# Altium schematic sheet [04]USB.SchDoc
size A4
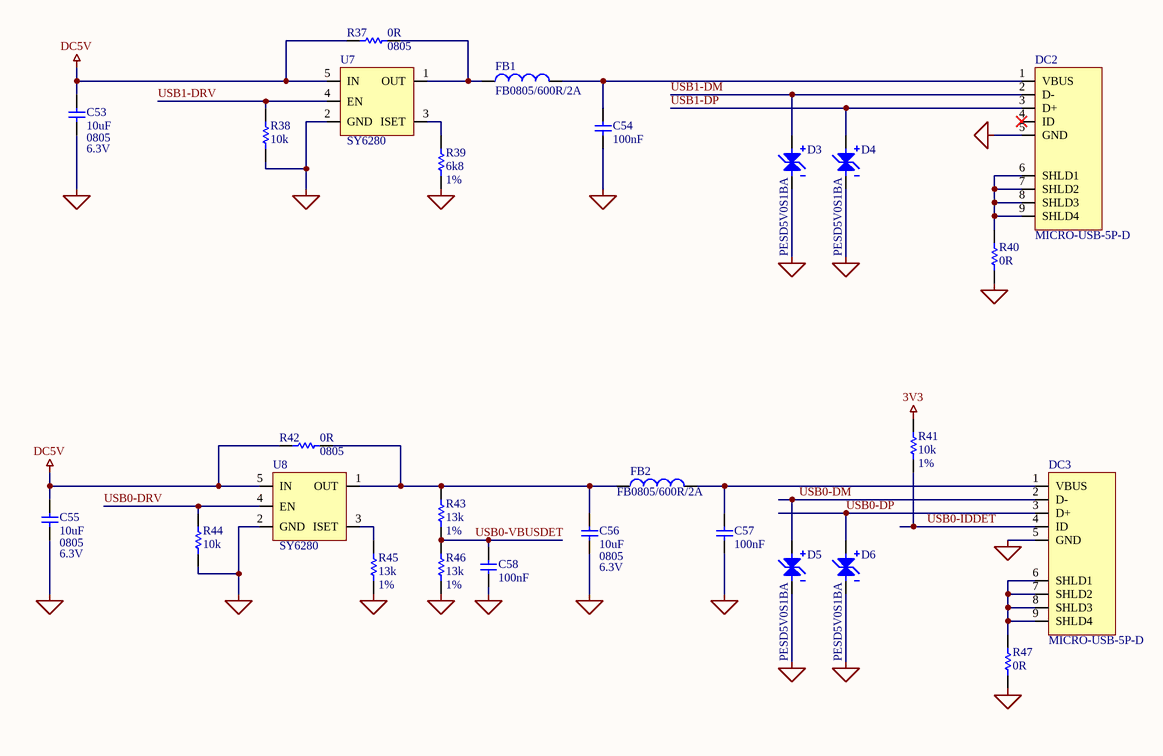
[diagram p0: [04]USB.SchDoc]

## Parts
C53  value 10uF  Voltage: 6.3V  Package / Case: 0805  [C0805]  (hidden comment: SMD Capacitor Chip)
C54  value 100nF  [C0402]  (hidden comment: SMD Capacitor Chip)
C55  value 10uF  Voltage: 6.3V  Package / Case: 0805  [C0805]  (hidden comment: SMD Capacitor Chip)
C56  value 10uF  Voltage: 6.3V  Package / Case: 0805  [C0805]  (hidden comment: SMD Capacitor Chip)
C57  value 100nF  [C0402]  (hidden comment: SMD Capacitor Chip)
C58  value 100nF  [C0402]  (hidden comment: SMD Capacitor Chip)
D3  MPN: PESD5V0S1BA  (hidden comment: SMD ESD Diode)
D4  MPN: PESD5V0S1BA  (hidden comment: SMD ESD Diode)
D5  MPN: PESD5V0S1BA  (hidden comment: SMD ESD Diode)
D6  MPN: PESD5V0S1BA  (hidden comment: SMD ESD Diode)
DC2  MPN: MICRO-USB-5P-D  (hidden comment: SMD USB Jack)
DC3  MPN: MICRO-USB-5P-D  (hidden comment: SMD USB Jack)
FB1  value FB0805/600R/2A  (hidden comment: SMD Coil Chip)
FB2  value FB0805/600R/2A  (hidden comment: SMD Coil Chip)
R37  value 0R  Package / Case: 0805  (hidden comment: SMD Resistor Chip)
R38  value 10k  (hidden comment: SMD Resistor Chip)
R39  value 6k8  Tolerance: 1%  (hidden comment: SMD Resistor Chip)
R40  value 0R  (hidden comment: SMD Resistor Chip)
R41  value 10k  Tolerance: 1%  (hidden comment: SMD Resistor Chip)
R42  value 0R  Package / Case: 0805  (hidden comment: SMD Resistor Chip)
R43  value 13k  Tolerance: 1%  (hidden comment: SMD Resistor Chip)
R44  value 10k  (hidden comment: SMD Resistor Chip)
R45  value 13k  Tolerance: 1%  (hidden comment: SMD Resistor Chip)
R46  value 13k  Tolerance: 1%  (hidden comment: SMD Resistor Chip)
R47  value 0R  (hidden comment: SMD Resistor Chip)
U7  SMD Power Distribution Switch  (value not drawn)
U8  SMD Power Distribution Switch  (value not drawn)

## Nets
3V3: R41.1
DC5V: C53.1 C55.1 R37.1 R42.1 U7.5(IN) U8.5(IN)
SGND: C53.2 C54.1 C55.2 C56.2 C57.1 C58.1 D3.2 D4.2 D5.2 D6.2 DC2.5(GND) DC3.5(GND) R38.2 R39.2 R40.2 R44.2 R45.2 R46.2 R47.2 U7.2(GND) U8.2(GND)
USB0-DM: D5.1 DC3.2(D-)
USB0-DP: D6.1 DC3.3(D+)
USB0-DRV: R44.1 U8.4(EN)
USB0-IDDET: DC3.4(ID) R41.2
USB0-VBUSDET: C58.2 R43.2 R46.1
USB1-DM: D3.1 DC2.2(D-)
USB1-DP: D4.1 DC2.3(D+)
USB1-DRV: R38.1 U7.4(EN)
NetC54_2: C54.2 DC2.1(VBUS) FB1.2
NetC56_1: C56.1 FB2.1 R42.2 R43.1 U8.1(OUT)
NetC57_2: C57.2 DC3.1(VBUS) FB2.2
NetDC2_6: DC2.6(SHLD1) DC2.7(SHLD2) DC2.8(SHLD3) DC2.9(SHLD4) R40.1
NetDC3_6: DC3.6(SHLD1) DC3.7(SHLD2) DC3.8(SHLD3) DC3.9(SHLD4) R47.1
NetFB1_1: FB1.1 R37.2 U7.1(OUT)
NetR39_1: R39.1 U7.3(ISET)
NetR45_1: R45.1 U8.3(ISET)

Not connected (* = marked no-connect by the designer): DC2 4(ID)*

## Library data of the parts
C53 C55 C56 = CAP: SMD Capacitor; Tolerance: 20%; MPN: ?
C54 C57 C58 = CAP: SMD Capacitor; Tolerance: 20%; Voltage: 50V; MPN: ?; Package / Case: 0402
D3-D6 = DIODE ESD: SMD ESD Diode Chip; Manufacturer: ?
DC2 DC3 = USB-JACK: SMD USB DC Jack
FB1 FB2 = COIL: SMD Coil; Current Rating: 1A; Inductance: 4.7uH; MPN: ?; Series Resistance: ?
R37 R38 R40 R42 R44 R47 = RES: SMD Resistor; Tolerance: 1%; MPN: ?
  R38 R40 R44 R47: Package / Case: 0603
R39 R41 R43 R45 R46 = RES: SMD Resistor; Package / Case: 0603; MPN: ?
U7 U8 = SY6280: Low Loss Power Distribution Switch; Manufacturer: SILERGY; MPN: SY6280